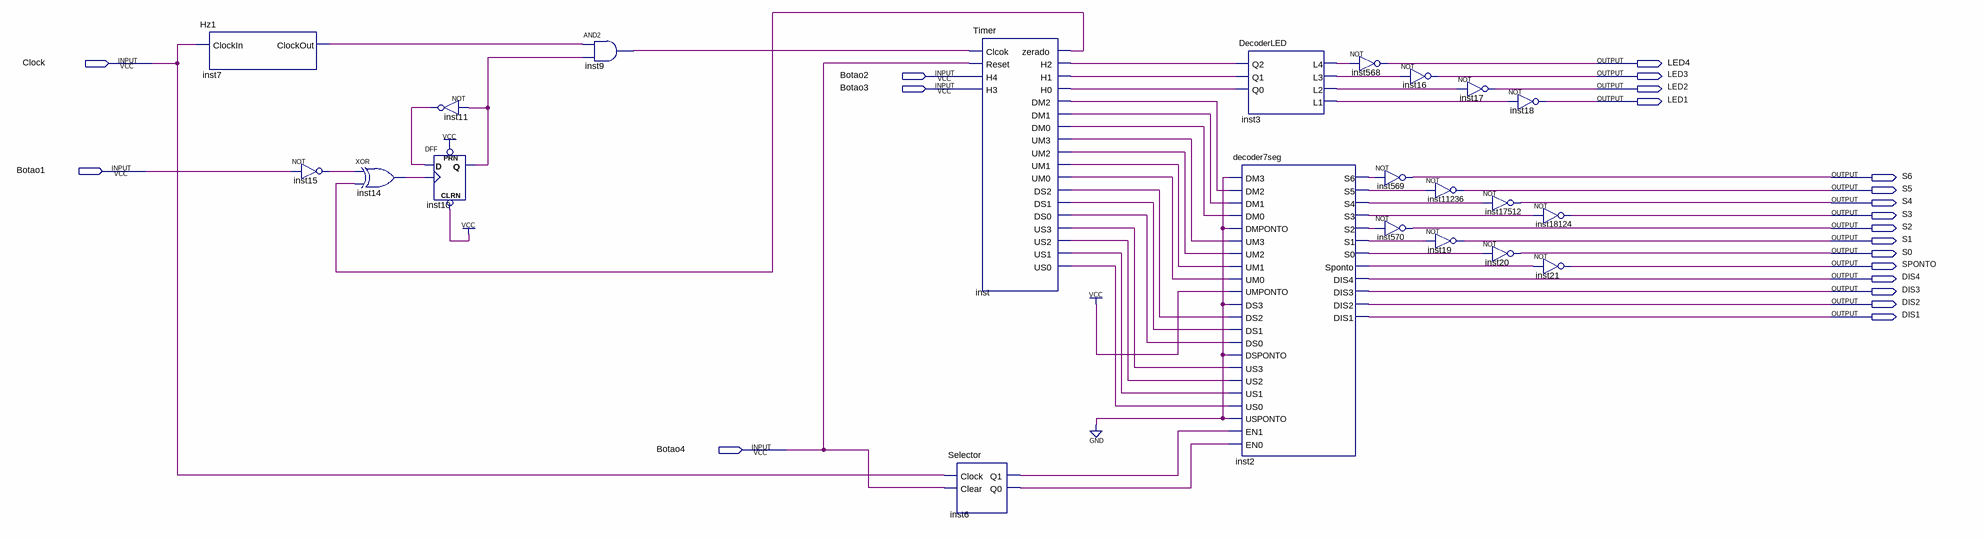
[diagram p0: schematic sheet]
// Quartus schematic Relogio.bdf as structural Verilog: 22 symbols, 21 pins
module Relogio (
  input  Clock,
  input  Botao2,
  input  Botao3,
  input  Botao1,
  input  Botao4,
  output LED4,
  output LED3,
  output LED2,
  output LED1,
  output S6,
  output S5,
  output S4,
  output S3,
  output S2,
  output S1,
  output S0,
  output SPONTO,
  output DIS4,
  output DIS3,
  output DIS2,
  output DIS1
);

  wire inst2_s0, inst2_s1, inst2_s2, inst2_s3, inst2_s4, inst2_s5, inst2_s6, inst2_sponto, inst3_l1,
       inst3_l2, inst3_l3, inst3_l4, inst6_q0, inst6_q1, inst7_clockout, inst9_out, inst10_q, inst11_out,
       inst14_out, inst15_out, inst_dm0, inst_dm1, inst_dm2, inst_ds0, inst_ds1, inst_ds2, inst_h0, inst_h1,
       inst_h2, inst_um0, inst_um1, inst_um2, inst_um3, inst_us0, inst_us1, inst_us2, inst_us3, inst_zerado;

  Hz1 inst7 (.ClockIn(Clock), .ClockOut(inst7_clockout));
  not inst15 (inst15_out, Botao1);
  xor inst14 (inst14_out, inst15_out, inst_zerado);
  not inst11 (inst11_out, inst10_q);
  DFF inst10 (.CLRN(1'b1), .CLK(inst14_out), .D(inst11_out), .PRN(1'b1), .Q(inst10_q));
  and inst9 (inst9_out, inst7_clockout, inst10_q);
  Timer inst (
    .Clcok(inst9_out), .Reset(Botao4), .H4(Botao2), .H3(Botao3), .zerado(inst_zerado), .H2(inst_h2),
    .H1(inst_h1), .H0(inst_h0), .DM2(inst_dm2), .DM1(inst_dm1), .DM0(inst_dm0), .UM3(inst_um3),
    .UM2(inst_um2), .UM1(inst_um1), .UM0(inst_um0), .DS2(inst_ds2), .DS1(inst_ds1), .DS0(inst_ds0),
    .US3(inst_us3), .US2(inst_us2), .US1(inst_us1), .US0(inst_us0));
  Selector inst6 (.Clock(Clock), .Clear(Botao4), .Q1(inst6_q1), .Q0(inst6_q0));
  DecoderLED inst3 (
    .Q2(inst_h2), .Q1(inst_h1), .Q0(inst_h0), .L4(inst3_l4), .L3(inst3_l3), .L2(inst3_l2), .L1(inst3_l1));
  decoder7seg inst2 (
    .DM3(1'b0), .DM2(inst_dm2), .DM1(inst_dm1), .DM0(inst_dm0), .DMPONTO(1'b0), .UM3(inst_um3),
    .UM2(inst_um2), .UM1(inst_um1), .UM0(inst_um0), .UMPONTO(1'b1), .DS3(1'b0), .DS2(inst_ds2),
    .DS1(inst_ds1), .DS0(inst_ds0), .DSPONTO(1'b0), .US3(inst_us3), .US2(inst_us2), .US1(inst_us1),
    .US0(inst_us0), .USPONTO(1'b0), .EN1(inst6_q1), .EN0(inst6_q0), .S6(inst2_s6), .S5(inst2_s5),
    .S4(inst2_s4), .S3(inst2_s3), .S2(inst2_s2), .S1(inst2_s1), .S0(inst2_s0), .Sponto(inst2_sponto),
    .DIS4(DIS4), .DIS3(DIS3), .DIS2(DIS2), .DIS1(DIS1));
  not inst568 (LED4, inst3_l4);
  not inst569 (S6, inst2_s6);
  not inst570 (S2, inst2_s2);
  not inst16 (LED3, inst3_l3);
  not inst11236 (S5, inst2_s5);
  not inst19 (S1, inst2_s1);
  not inst17 (LED2, inst3_l2);
  not inst18 (LED1, inst3_l1);
  not inst17512 (S4, inst2_s4);
  not inst20 (S0, inst2_s0);
  not inst18124 (S3, inst2_s3);
  not inst21 (SPONTO, inst2_sponto);
endmodule
